# Altium schematic sheet MCU_STM32.SchDoc
size A; SheetNumber: 2; SheetTotal: 11
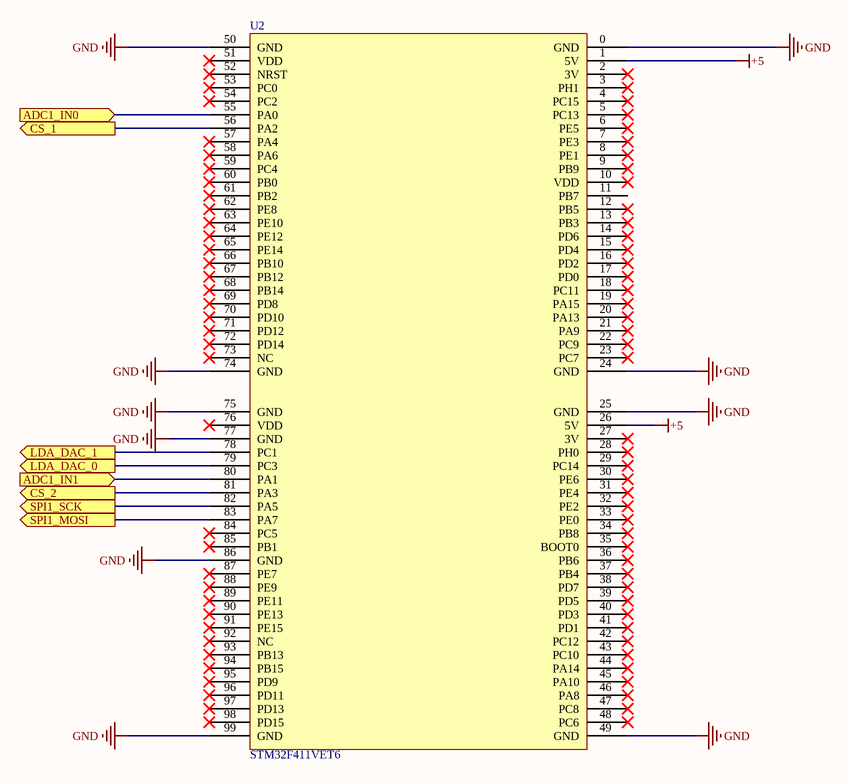
[diagram p0: MCU_STM32.SchDoc]

## Parts
U2  STM32F411VET6  [STM32F4]

## Ports
ADC1_IN0 (in), ADC1_IN1 (in), CS_1 (out), CS_2 (out), LDA_DAC_0 (out), LDA_DAC_1 (out), SPI1_MOSI (out), SPI1_SCK (out)

## Nets
+5: U2.1(5V) U2.26(5V)
GND: U2.0(GND) U2.24(GND) U2.25(GND) U2.49(GND) U2.50(GND) U2.74(GND) U2.75(GND) U2.77(GND) U2.86(GND) U2.99(GND)
ADC1_IN0: U2.55(PA0) ; port ADC1_IN0
ADC1_IN1: U2.80(PA1) ; port ADC1_IN1
CS_1: U2.56(PA2) ; port CS_1
CS_2: U2.81(PA3) ; port CS_2
LDA_DAC_0: U2.79(PC3) ; port LDA_DAC_0
LDA_DAC_1: U2.78(PC1) ; port LDA_DAC_1
SPI1_MOSI: U2.83(PA7) ; port SPI1_MOSI
SPI1_SCK: U2.82(PA5) ; port SPI1_SCK

Not connected (* = marked no-connect by the designer): U2 2(3V)* 3(PH1)* 4(PC15)* 5(PC13)* 6(PE5)* 7(PE3)* 8(PE1)* 9(PB9)* 10(VDD)* 11(PB7) 12(PB5)* 13(PB3)* 14(PD6)* 15(PD4)* 16(PD2)* 17(PD0)* 18(PC11)* 19(PA15)* 20(PA13)* 21(PA9)* 22(PC9)* 23(PC7)* 27(3V)* 28(PH0)* 29(PC14)* 30(PE6)* 31(PE4)* 32(PE2)* 33(PE0)* 34(PB8)* 35(BOOT0)* 36(PB6)* 37(PB4)* 38(PD7)* 39(PD5)* 40(PD3)* 41(PD1)* 42(PC12)* 43(PC10)* 44(PA14)* 45(PA10)* 46(PA8)* 47(PC8)* 48(PC6)* 51(VDD)* 52(NRST)* 53(PC0)* 54(PC2)* 57(PA4)* 58(PA6)* 59(PC4)* 60(PB0)* 61(PB2)* 62(PE8)* 63(PE10)* 64(PE12)* 65(PE14)* 66(PB10)* 67(PB12)* 68(PB14)* 69(PD8)* 70(PD10)* 71(PD12)* 72(PD14)* 73(NC)* 76(VDD)* 84(PC5)* 85(PB1)* 87(PE7)* 88(PE9)* 89(PE11)* 90(PE13)* 91(PE15)* 92(NC)* 93(PB13)* 94(PB15)* 95(PD9)* 96(PD11)* 97(PD13)* 98(PD15)*